# Altium project 1-Tamrin AvalProject.PrjPcb
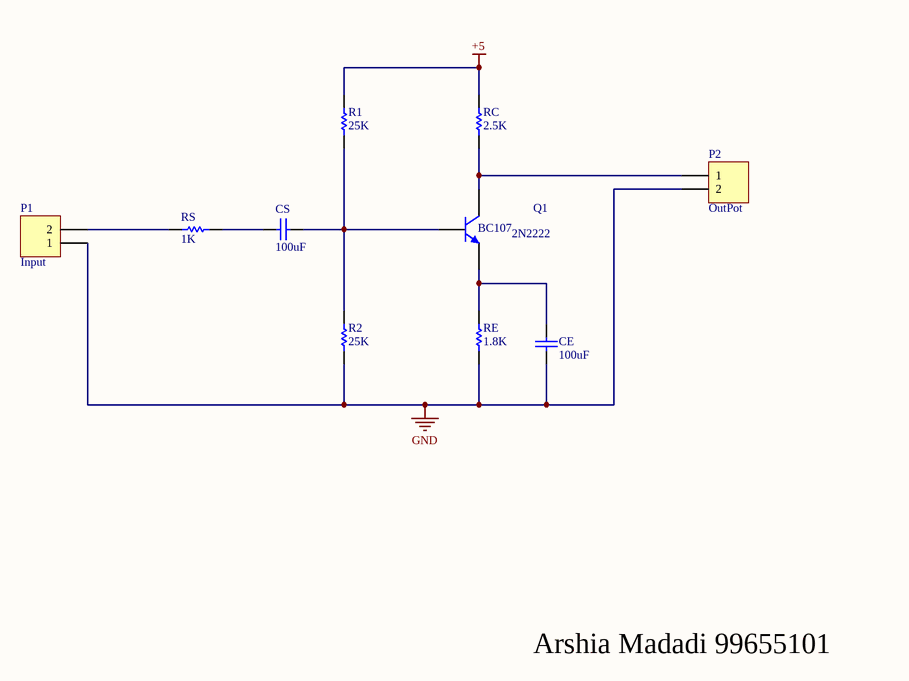
[diagram p0: 1-Tamrin Aval.SchDoc]
1 sheet, 10 parts. Net scope: global (net labels, ports and power ports of the same name join across sheets).
Board file: 1-Tamrin Aval.PcbDoc

## Sheet 1-Tamrin Aval.SchDoc
size A; SheetNumber: 1; SheetTotal: 1

### Parts
CE  100uF  [CAPC4817X12N]
CS  100uF  [CAPC4817X12N]
P1  Input  [HDR1X2]
P2  OutPot  [HDR1X2]
Q1  2N2222  [2N2222]
R1  25K  [RESC4817X04N]
R2  25K  [RESC4817X04N]
RC  2.5K  [RESC4817X04N]
RE  1.8K  [RESC4817X04N]
RS  1K  [RESC4817X04N]

### Nets
+5: R1.2 RC.2
GND: CE.1 P1.1 P2.2 R2.1 RE.1
NetCE_2: CE.2 Q1.1(E) RE.2
NetCS_1: CS.1 Q1.2(B) R1.1 R2.2
NetCS_2: CS.2 RS.1
NetP1_2: P1.2 RS.2
NetP2_1: P2.1 Q1.3(C) RC.1

### Notes on the sheet
- Arshia Madadi 99655101
- (in symbol 2N2222) BC107

### Library data of the parts
CE CS = CAP SMD 1206: CAP 1206; Designer: Abbas Basereh; Desc.: CAP SMD 1206; Data: 16-12-2016
P1 P2 = Header 2: Header, 2-Pin; LatestRevisionDate: 17-Jul-2002; LatestRevisionNote: Re-released for DXP Platform.; Publisher: Altium Limited
Q1 = 2N2222: NPN Transistor
R1 R2 RC RE RS = RES 1206 0.25W: RES 1206; Designer: Abbas Basereh; Desc.: RES SMD 1206; Data: 16-12-2016